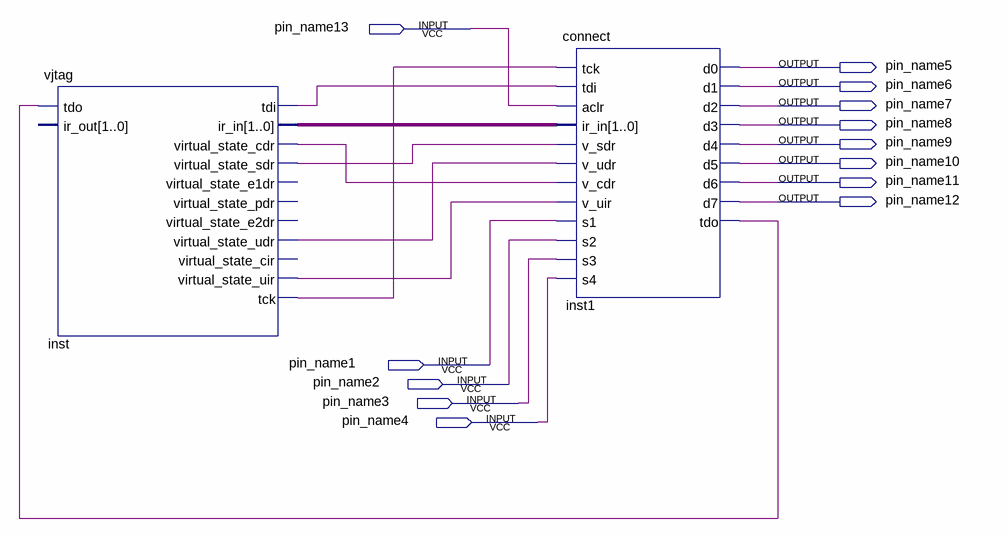
[diagram p0: schematic sheet]
// Quartus schematic schematic.bdf as structural Verilog: 2 symbols, 13 pins
module schematic (
  input  pin_name13,
  input  pin_name1,
  input  pin_name2,
  input  pin_name3,
  input  pin_name4,
  output pin_name5,
  output pin_name6,
  output pin_name7,
  output pin_name8,
  output pin_name9,
  output pin_name10,
  output pin_name11,
  output pin_name12
);

  wire inst1_tdo, inst_tck, inst_tdi, inst_virtual_state_cdr, inst_virtual_state_sdr, inst_virtual_state_udr,
       inst_virtual_state_uir;
  wire [1:0] inst_ir_in;

  vjtag inst (
    .tdo(inst1_tdo), .tdi(inst_tdi), .ir_in(inst_ir_in), .virtual_state_cdr(inst_virtual_state_cdr),
    .virtual_state_sdr(inst_virtual_state_sdr), .virtual_state_udr(inst_virtual_state_udr),
    .virtual_state_uir(inst_virtual_state_uir), .tck(inst_tck));  // open: ir_out, virtual_state_e1dr, virtual_state_pdr, virtual_state_e2dr, virtual_state_cir
  connect inst1 (
    .tck(inst_tck), .tdi(inst_tdi), .aclr(pin_name13), .ir_in(inst_ir_in), .v_sdr(inst_virtual_state_sdr),
    .v_udr(inst_virtual_state_udr), .v_cdr(inst_virtual_state_cdr), .v_uir(inst_virtual_state_uir),
    .s1(pin_name1), .s2(pin_name2), .s3(pin_name3), .s4(pin_name4), .d0(pin_name5), .d1(pin_name6),
    .d2(pin_name7), .d3(pin_name8), .d4(pin_name9), .d5(pin_name10), .d6(pin_name11), .d7(pin_name12),
    .tdo(inst1_tdo));
endmodule
